# Altium schematic sheet 电机驱动原理图.SchDoc
size A4
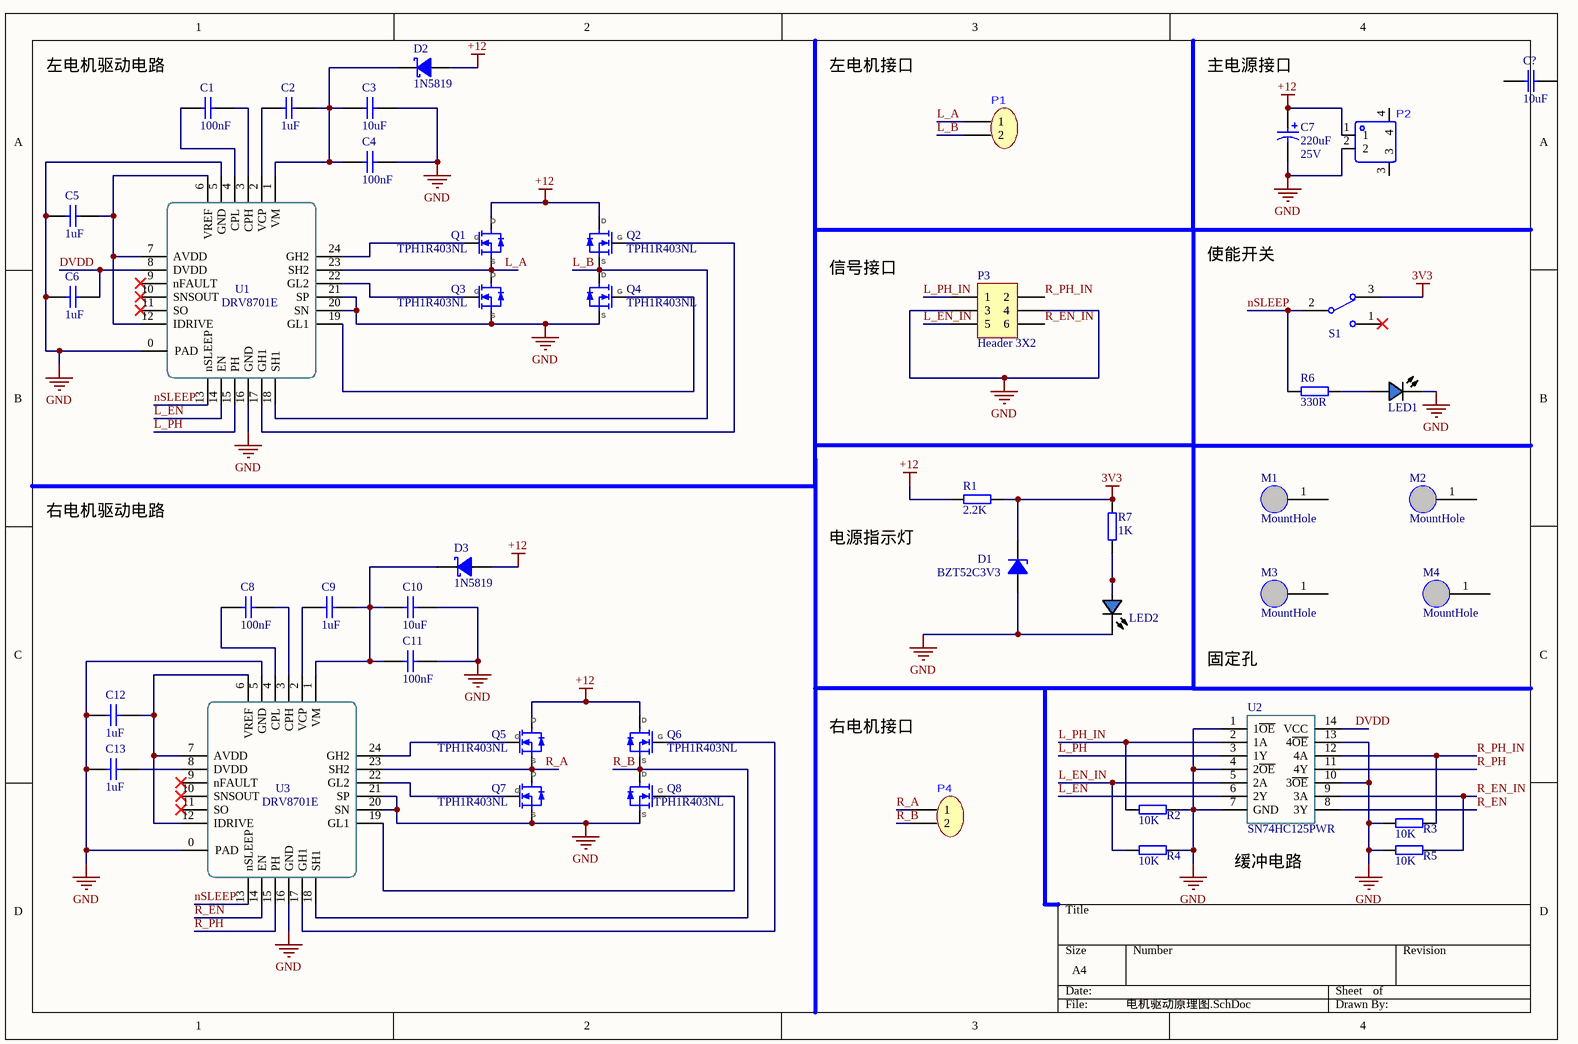
[diagram p0: 电机驱动原理图.SchDoc]

## Parts
C1  value 100nF  [CAPC1608[0603]S-N]  (hidden comment: 100nF ±10% 50V)
C2  value 1uF  [CAPC1608[0603]S-N]  (hidden comment: 1uF ±10% 25V)
C3  value 10uF  [CAPC2012[0805]S-N]  (hidden comment: 10uF ±10% 25V)
C4  value 100nF  [CAPC1608[0603]S-N]  (hidden comment: 100nF ±10% 50V)
C5  value 1uF  [CAPC1608[0603]S-N]  (hidden comment: 1uF ±10% 25V)
C6  value 1uF  [CAPC1608[0603]S-N]  (hidden comment: 1uF ±10% 25V)
C7  value 220uF  Voltage: 25V  [CAPPR3.5-8X11.5]  (hidden comment: 220uF 25V)
C8  value 100nF  [CAPC1608[0603]S-N]  (hidden comment: 100nF ±10% 50V)
C9  value 1uF  [CAPC1608[0603]S-N]  (hidden comment: 1uF ±10% 25V)
C10  value 10uF  [CAPC2012[0805]S-N]  (hidden comment: 10uF ±10% 25V)
C11  value 100nF  [CAPC1608[0603]S-N]  (hidden comment: 100nF ±10% 50V)
C12  value 1uF  [CAPC1608[0603]S-N]  (hidden comment: 1uF ±10% 25V)
C13  value 1uF  [CAPC1608[0603]S-N]  (hidden comment: 1uF ±10% 25V)
C?  value 10uF  [CAPC2012[0805]S-N]  (hidden comment: 10uF ±10% 25V)
D1  BZT52C3V3  [SOD-123-L]
D2  1N5819  [SOD-123-L]
D3  1N5819  [SOD-123-L]
LED1  Blue  [LEDC1608(0603)]  (value not drawn)
LED2  Blue  [LEDC1608(0603)]  (value not drawn)
M1  MountHole  [M3-MountSlot]  (no BOM)
M2  MountHole  [M3-MountSlot]  (no BOM)
M3  MountHole  [M3-MountSlot]  (no BOM)
M4  MountHole  [M3-MountSlot]  (no BOM)
P1  (no value)  [XT30UPB-M]
P2  (no value)  [CONN-TH_XT30PW-F]
P3  Header 3X2  [HDR2X3]
P4  (no value)  [XT30UPB-M]
Q1  TPH1R403NL  [DFN5x6]
Q2  TPH1R403NL  [DFN5x6]
Q3  TPH1R403NL  [DFN5x6]
Q4  TPH1R403NL  [DFN5x6]
Q5  TPH1R403NL  [DFN5x6]
Q6  TPH1R403NL  [DFN5x6]
Q7  TPH1R403NL  [DFN5x6]
Q8  TPH1R403NL  [DFN5x6]
R1  value 2.2K  [RESC1608[0603]S-N]  (hidden comment: 2.2K ±1%)
R2  value 10K  [RESC1608[0603]S-N]  (hidden comment: 10K ±1%)
R3  value 10K  [RESC1608[0603]S-N]  (hidden comment: 10K ±1%)
R4  value 10K  [RESC1608[0603]S-N]  (hidden comment: 10K ±1%)
R5  value 10K  [RESC1608[0603]S-N]  (hidden comment: 10K ±1%)
R6  value 330R  [RESC1608[0603]S-N]  (hidden comment: 330R ±1%)
R7  value 1K  [RESC1608[0603]S-N]  (hidden comment: 1K ±1%)
S1  SW-SPDT  [SS12D10]  (value not drawn)
U1  DRV8701E  [QFN24-4x4]
U2  SN74HC125PWR  [TSSOP-14]
U3  DRV8701E  [QFN24-4x4]

## Nets
3V3: D1.K R1.2 R7.1 S1.3
+12: C7.1 D2.A D3.A P2.1 Q1.1(D) Q2.1(D) Q5.1(D) Q6.1(D) R1.1
GND: C3.2 C4.2 C5.1 C6.1 C7.2 C10.2 C11.2 C12.1 C13.1 D1.A LED1.C LED2.C P2.2 P3.3 P3.4 Q3.3(S) Q4.3(S) Q7.3(S) Q8.3(S) R2.2 R3.1 R4.2 R5.1 U1.0(PAD) U1.5(GND) U1.16(GND) U1.20(SN) U1.21(SP) U2.1(1~{OE}) U2.4(2~{OE}) U2.7(GND) U2.10(3~{OE}) U2.13(4~{OE}) U3.0(PAD) U3.5(GND) U3.16(GND) U3.20(SN) U3.21(SP)
DVDD: C6.2 U1.8(DVDD) U2.14(VCC)
L_A: P1.1 Q1.3(S) Q3.1(D) U1.23(SH2)
L_B: P1.2 Q2.3(S) Q4.1(D) U1.18(SH1)
L_EN: U1.14(EN) U2.6(2Y)
L_EN_IN: P3.5 R4.1 U2.5(2A)
L_PH: U1.15(PH) U2.3(1Y)
L_PH_IN: P3.1 R2.1 U2.2(1A)
nSLEEP: R6.1 S1.2 U1.13(nSLEEP) U3.13(nSLEEP)
R_A: P4.1 Q5.3(S) Q7.1(D) U3.23(SH2)
R_B: P4.2 Q6.3(S) Q8.1(D) U3.18(SH1)
R_EN: U2.8(3Y) U3.14(EN)
R_EN_IN: P3.6 R5.2 U2.9(3A)
R_PH: U2.11(4Y) U3.15(PH)
R_PH_IN: P3.2 R3.2 U2.12(4A)
NetC1_1: C1.1 U1.4(CPL)
NetC1_2: C1.2 U1.3(CPH)
NetC2_1: C2.1 U1.2(VCP)
NetC2_2: C2.2 C3.1 C4.1 D2.K U1.1(VM)
NetC5_2: C5.2 U1.6(VREF) U1.7(AVDD) U1.12(IDRIVE)
NetC8_1: C8.1 U3.4(CPL)
NetC8_2: C8.2 U3.3(CPH)
NetC9_1: C9.1 U3.2(VCP)
NetC9_2: C9.2 C10.1 C11.1 D3.K U3.1(VM)
NetC12_2: C12.2 U3.6(VREF) U3.7(AVDD) U3.12(IDRIVE)
NetC13_2: C13.2 U3.8(DVDD)
NetLED1_A: LED1.A R6.2
NetLED2_A: LED2.A R7.2
NetQ1_2: Q1.2(G) U1.24(GH2)
NetQ2_2: Q2.2(G) U1.17(GH1)
NetQ3_2: Q3.2(G) U1.22(GL2)
NetQ4_2: Q4.2(G) U1.19(GL1)
NetQ5_2: Q5.2(G) U3.24(GH2)
NetQ6_2: Q6.2(G) U3.17(GH1)
NetQ7_2: Q7.2(G) U3.22(GL2)
NetQ8_2: Q8.2(G) U3.19(GL1)

Not connected (* = marked no-connect by the designer): C? 1 2; M1 1; M2 1; M3 1; M4 1; P2 3 4; S1 1*; U1 9(nFAULT)* 10(SNSOUT)* 11(SO)*; U3 9(nFAULT)* 10(SNSOUT)* 11(SO)*

## Notes on the sheet
- (near C1) 左电机驱动电路
- (near P1) 左电机接口
- 主电源接口
- (near P3) 信号接口
- (near S1) 使能开关
- 右电机驱动电路
- (near D1) 电源指示灯
- 固定孔
- 右电机接口
- (near R5) 缓冲电路

## Library data of the parts
C1 C4 C8 C11 = Cap-Chip_1: 贴片电容; Published: 8-Jun-2000; Revision: July-2002: Re-released for DXP Platform.; Publisher: Altium Limited; Price(RMB): 0.000; Voltage: 50V; Tolerance: ±10%
C2 C5 C6 C9 C12 C13 = Cap-Chip_2: 贴片电容; Published: 8-Jun-2000; Revision: July-2002: Re-released for DXP Platform.; Publisher: Altium Limited; Price(RMB): 0.000; Voltage: 25V; Tolerance: ±10%
C3 C10 C? = Cap-Chip: 贴片电容; Published: 8-Jun-2000; Revision: July-2002: Re-released for DXP Platform.; Publisher: Altium Limited; Price(RMB): 0.000; Voltage: 25V; Tolerance: ±10%
C7 = Cap-Elect: Polarized Capacitor (Radial); Published: 8-Jun-2000; Revision: July-2002: Re-released for DXP Platform.; Publisher: Altium Limited; Price(RMB): 0.000
D1 = Diode Zen: 3.3V稳压二极管 SOD-123; Published: 8-Jun-2000; Revision: July-2002: Re-released for DXP Platform.; Publisher: Altium Limited; Price(RMB): 0.000
D2 D3 = Diode Schottky: 肖特基二极管 Diode; Imax: 500mA; Published: 8-Jun-2000; Revision: July-2002: Re-released for DXP Platform.; Publisher: Altium Limited; Price(RMB): 0.000; PartNumber: 1N5819
LED1 LED2 = LED Chip Blue: Typical Chip LED; Published: 8-Jun-2000; Revision: July-2002: Re-released for DXP Platform.; Publisher: Altium Limited; Price(RMB): 0.00; Color: Blue
M1-M4 = MountHole: 固定孔
P1 P4 = XT30: 电机接口
P2 = XT30PW-F: XT30电源接口
P3 = Header 3X2: Header, 3-Pin, Dual row; LatestRevisionDate: 17-Jul-2002; LatestRevisionNote: Re-released for DXP Platform.; Publisher: Altium Limited; Price(RMB): 0.00
Q1-Q8 = TPH1R403NL: 东芝 N沟 MOS
R1 = Res-Chip: 贴片电阻; Published: 8-Jun-2000; Revision: July-2002: Re-released for DXP Platform.; Publisher: Altium Limited; Price(RMB): 0.000; Tolerance: ±1%
R2-R5 = Res-Chip_1: 贴片电阻; Published: 8-Jun-2000; Revision: July-2002: Re-released for DXP Platform.; Publisher: Altium Limited; Price(RMB): 0.000; Tolerance: ±1%
R6 = Res-Chip_3: 贴片电阻; Published: 8-Jun-2000; Revision: July-2002: Re-released for DXP Platform.; Publisher: Altium Limited; Price(RMB): 0.000; Tolerance: ±1%
R7 = Res-Chip_2: 贴片电阻; Published: 8-Jun-2000; Revision: July-2002: Re-released for DXP Platform.; Publisher: Altium Limited; Price(RMB): 0.000; Tolerance: ±1%
S1 = SW-SPDT: 单刀双掷开关 3脚船型、钮子、拨动开关 SPDT Subminiature Toggle Switch; Published: 24-Mar-1999; Publisher: Altium Limited; Price(RMB): 0.000
U1 U3 = DRV8701E: DRV8701E Ti全桥驱动芯片
U2 = SN74HC125PWR: 三态输出的四路缓冲器 TSSOP-20